# EAGLE design MTX_pic_piggyback (EAGLE 6.5.0)
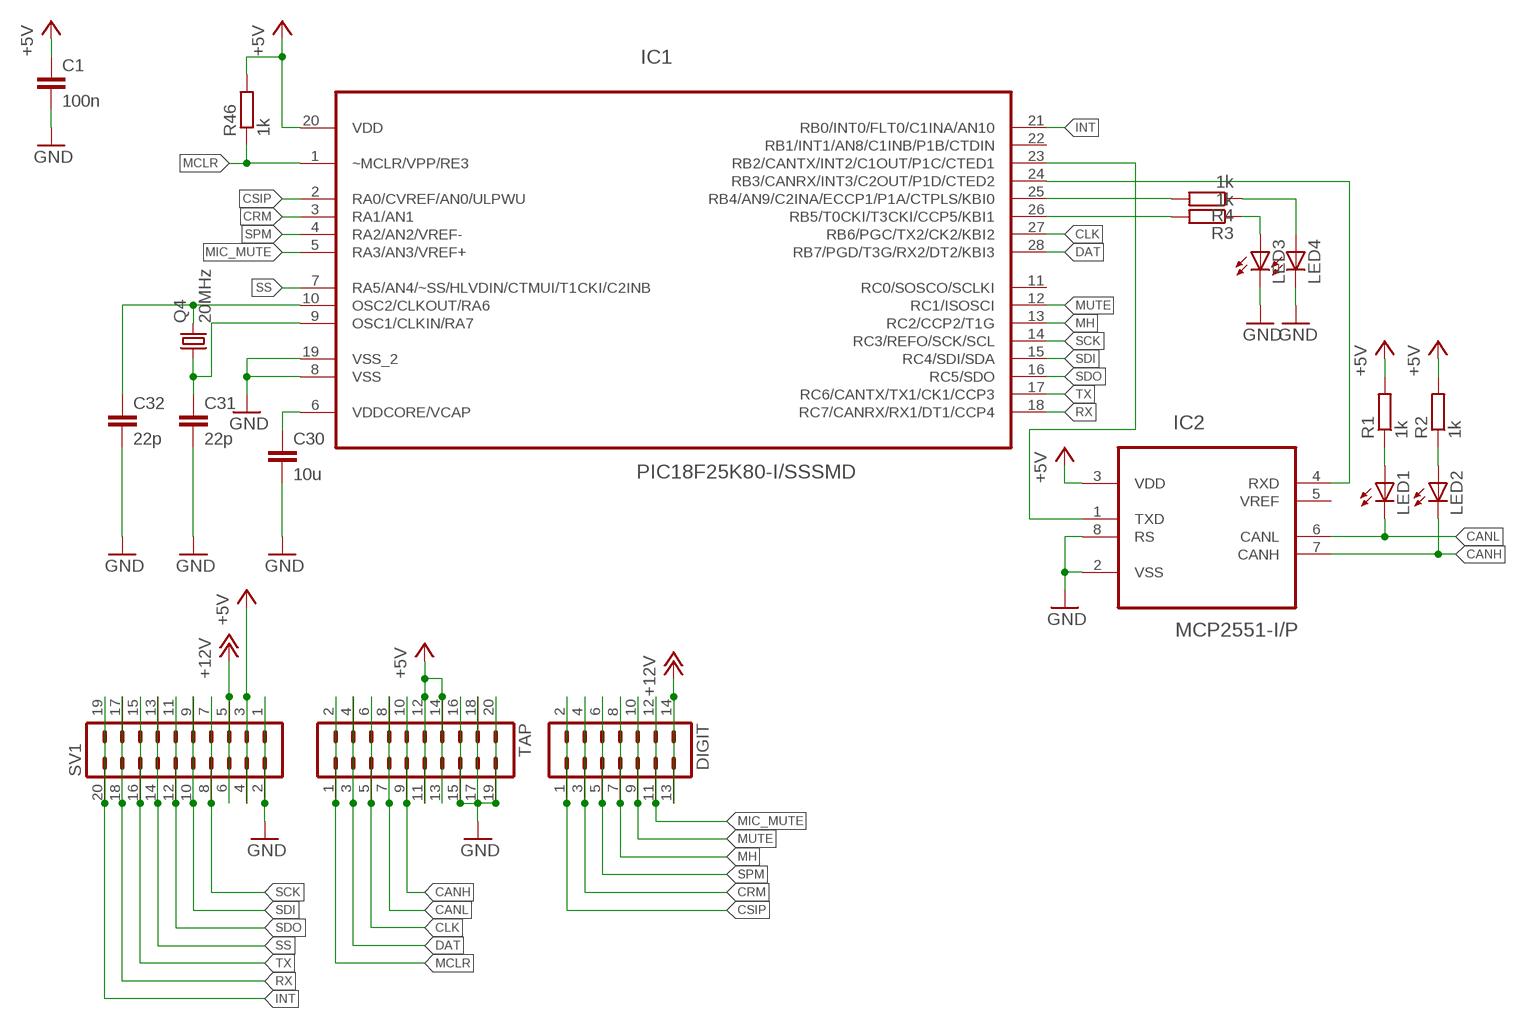
[diagram p0: schematic, sheet 1]

## Parts
C1  100n  C-EUC0805  [C0805]
C30  10u  C-EUC0805  [C0805]
C31  22p  C-EUC0805  [C0805]
C32  22p  C-EUC0805  [C0805]
DIGIT  MA07-2  [MA07-2]
IC1  PIC18F25K80-I/SSSMD  [SOP65P780X200-28N]
IC2  MCP2551-I/P  [DIP254P762X432-8]
LED1  LEDCHIP-LED0805  [CHIP-LED0805]
LED2  LEDCHIP-LED0805  [CHIP-LED0805]
LED3  LEDCHIP-LED0805  [CHIP-LED0805]
LED4  LEDCHIP-LED0805  [CHIP-LED0805]
Q4  20MHz  CRYSTALHC49UP  [HC49UP]
R1  1k  R-EU_R0805  [R0805]
R2  1k  R-EU_R0805  [R0805]
R3  1k  R-EU_R0805  [R0805]
R4  1k  R-EU_R0805  [R0805]
R46  1k  R-EU_R0805  [R0805]
SV1  MA10-2  [MA10-2]
TAP  MA10-2  [MA10-2]

## Nets
+5V: C1.1 IC1.20(VDD) IC2.3(VDD) R1.2 R2.2 R46.2 SV1.3 SV1.4 TAP.11 TAP.12 TAP.13 TAP.14
+12V: DIGIT.13 DIGIT.14 SV1.5 SV1.6
CANH: IC2.7(CANH) LED2.C TAP.9 TAP.10
CANL: IC2.6(CANL) LED1.C TAP.7 TAP.8
CLK: IC1.27(RB6/PGC/TX2/CK2/KBI2) TAP.5 TAP.6
CRM: DIGIT.3 DIGIT.4 IC1.3(RA1/AN1)
CSIP: DIGIT.1 DIGIT.2 IC1.2(RA0/CVREF/AN0/ULPWU)
DAT: IC1.28(RB7/PGD/T3G/RX2/DT2/KBI3) TAP.3 TAP.4
GND: C1.2 C30.2 C31.2 C32.2 IC1.8(VSS) IC1.19(VSS_2) IC2.2(VSS) IC2.8(RS) LED3.C LED4.C SV1.1 SV1.2 TAP.15 TAP.16 TAP.17 TAP.18 TAP.19 TAP.20
INT: IC1.21(RB0/INT0/FLT0/C1INA/AN10) SV1.19 SV1.20
MCLR: IC1.1(~MCLR/VPP/RE3) R46.1 TAP.1 TAP.2
MH: DIGIT.7 DIGIT.8 IC1.13(RC2/CCP2/T1G)
MIC_MUTE: DIGIT.11 DIGIT.12 IC1.5(RA3/AN3/VREF+)
MUTE: DIGIT.9 DIGIT.10 IC1.12(RC1/ISOSCI)
N$1: LED1.A R1.1
N$2: LED2.A R2.1
N$3: LED3.A R3.1
N$4: IC1.26(RB5/T0CKI/T3CKI/CCP5/KBI1) R3.2
N$5: LED4.A R4.1
N$6: IC1.25(RB4/AN9/C2INA/ECCP1/P1A/CTPLS/KBI0) R4.2
N$57: C30.1 IC1.6(VDDCORE/VCAP)
N$58: C31.1 IC1.9(OSC1/CLKIN/RA7) Q4.1
N$59: C32.1 IC1.10(OSC2/CLKOUT/RA6) Q4.2
N$86: IC1.24(RB3/CANRX/INT3/C2OUT/P1D/CTED2) IC2.4(RXD)
N$87: IC1.23(RB2/CANTX/INT2/C1OUT/P1C/CTED1) IC2.1(TXD)
RX: IC1.18(RC7/CANRX/RX1/DT1/CCP4) SV1.17 SV1.18
SCK: IC1.14(RC3/REFO/SCK/SCL) SV1.7 SV1.8
SDI: IC1.15(RC4/SDI/SDA) SV1.9 SV1.10
SDO: IC1.16(RC5/SDO) SV1.11 SV1.12
SPM: DIGIT.5 DIGIT.6 IC1.4(RA2/AN2/VREF-)
SS: IC1.7(RA5/AN4/~SS/HLVDIN/CTMUI/T1CKI/C2INB) SV1.13 SV1.14
TX: IC1.17(RC6/CANTX/TX1/CK1/CCP3) SV1.15 SV1.16
Unconnected: IC1.11(RC0/SOSCO/SCLKI) IC1.22(RB1/INT1/AN8/C1INB/P1B/CTDIN) IC2.5(VREF)

## Library data of the parts
C1 C30-C32 = rcl:C-EU: CAPACITOR, European symbol
DIGIT = con-lstb:MA07-2: PIN HEADER; OC_FARNELL: unknown; OC_NEWARK: unknown
IC1 = Microchip_By_element14_Batch_1:PIC18F25K80-I/SS
IC2 = Microchip_By_element14_Batch_1:MCP2551-I/P: High-Speed CAN Transceiver; DESCRIPTION: CAN CTRL; MPN: MCP2551-I/P; OC_FARNELL: 1292240; OC_NEWARK: 61K2947; PACKAGE: PDIP-8; SUPPLIER: Microchip
LED1-LED4 = led:LED: LED OSRAM: - CHIPLED LG R971, LG N971, LY N971, LG Q971, LY Q971, LO R971, LY R971 LH N974, LH R974 LS Q976, LO Q976, LY Q976 LO Q996 - Hyper CHIPLED LW Q18S LB Q993, LB Q99A, LB R99A - SideLED LS A670, LO A670, LY A670, LG A670, LP A670 LB A673, LV A673, LT A673, LW A673 LH A674 LY A675 LS A676, LA A676, LO A676, LY A676, LW A676 LS A679, LY A679, LG A679 - Hyper Micro SIDELED® LS Y876, LA Y876, LO Y876, LY Y876 LT Y87S - SmartLED LW L88C, LW L88S LB L89C, LB L89S, LG L890 LS L89K, LO L89K, LY L89K LS L896, LA L896, LO L896, LY L896 - TOPLED LS T670, LO T670, LY T670, LG T670, LP T670 LSG T670, LSP T670, LSY T670, LOP T670, LYG T670 LG T671, LOG T671, LSG T671 LB T673, LV T673, LT T673, LW T673 LH T674 LS T676, LA T676, LO T676, LY T676, LB T676, LH T676, LSB T676, LW T676 LB T67C, LV T67C, LT T67C, LS T67K, LO T67K, LY T67K, LW E67C LS E67B, LA E67B, LO E67B, LY E67B, LB E67C, LV E67C, LT E67C LW T67C LS T679, LY T679, LG T679 LS T770, LO T770, LY T770, LG T770, LP T770 LB T773, LV T773, LT T773, LW T773 LH T774 LS E675, LA E675, LY E675, LS T675 LS T776, LA T776, LO T776, LY T776, LB T776 LHGB T686 LT T68C, LB T68C - Hyper Mini TOPLED® LB M676 - Mini TOPLED Santana® LG M470 LS M47K, LO M47K, LY M47K Source: http://www.osram.convergy.de LUXEON: - LUMILED® LXK2-PW12-R00, LXK2-PW12-S00, LXK2-PW14-U00, LXK2-PW14-V00 LXK2-PM12-R00, LXK2-PM12-S00, LXK2-PM14-U00 LXK2-PE12-Q00, LXK2-PE12-R00, LXK2-PE12-S00, LXK2-PE14-T00, LXK2-PE14-U00 LXK2-PB12-K00, LXK2-PB12-L00, LXK2-PB12-M00, LXK2-PB14-N00, LXK2-PB14-P00, LXK2-PB14-Q00 LXK2-PR12-L00, LXK2-PR12-M00, LXK2-PR14-Q00, LXK2-PR14-R00 LXK2-PD12-Q00, LXK2-PD12-R00, LXK2-PD12-S00 LXK2-PH12-R00, LXK2-PH12-S00 LXK2-PL12-P00, LXK2-PL12-Q00, LXK2-PL12-R00 Source: www.luxeon.com KINGBRIGHT: KA-3528ASYC Source: www.kingbright.com
Q4 = crystal:CRYSTAL: CRYSTAL; OC_FARNELL: unknown; OC_NEWARK: unknown
R1-R4 R46 = rcl:R-EU_: RESISTOR, European symbol
SV1 TAP = con-lstb:MA10-2: PIN HEADER; OC_FARNELL: unknown; OC_NEWARK: unknown

## Board
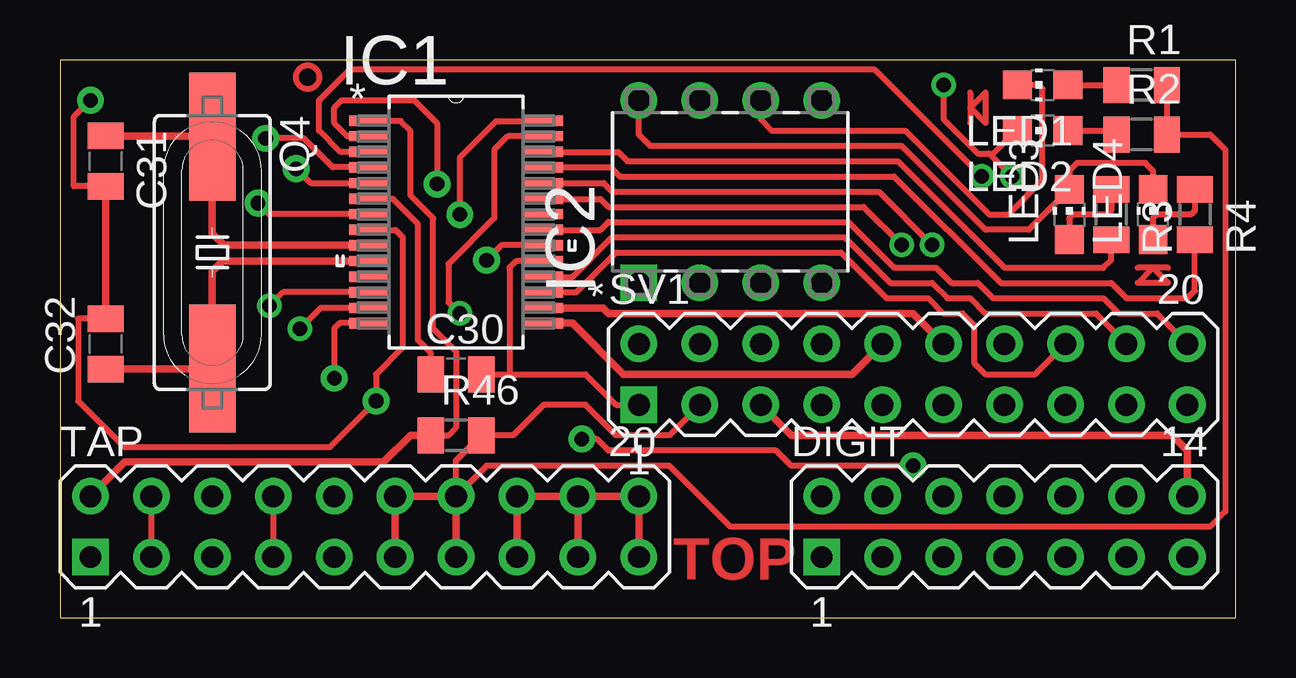
[diagram p1: board, top side]
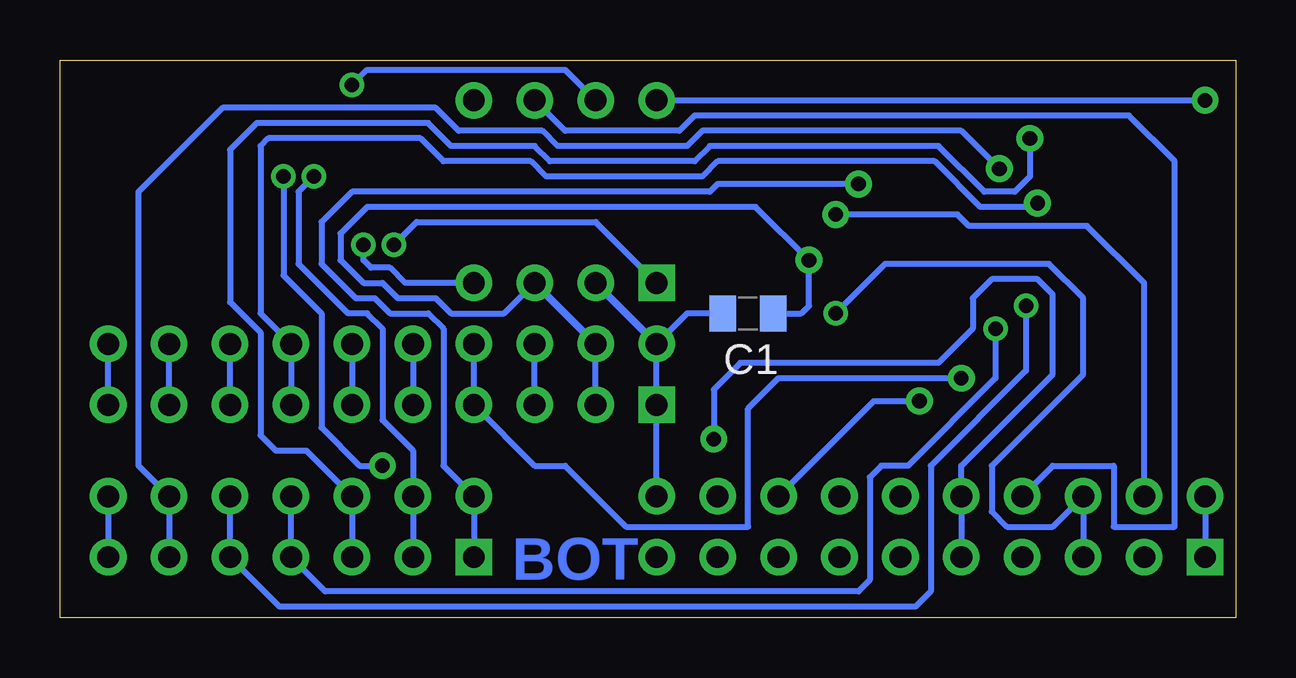
[diagram p2: board, bottom side, seen from below]

Size 49 x 23.27 mm. Coordinates in mm from the lower left corner, seen from the top.
Outline: 0,0 49,0 49,23.27 0,23.27 0,0
Copper layers (1*16): Top 0.035mm / dielectric 1.5mm / Bottom 0.035mm
Design rules "10mil": minimum track width 10mil, minimum drill 24mil, track to track 10mil, track to pad 10mil, pad to pad 10mil, via to via 10mil, smd to smd 10mil, copper to edge 10mil, drill to drill 10mil, minimum pad ring 10mil, minimum via ring 8mil, stop-mask expansion 4mil, vias tented up to drill 0mil, thermal gap 10mil

### Footprints (pad centres in the part's own frame; a part is rotated, then mirrored left to right if it is on the bottom)
C0805 = smd 1.1 x 1.5: 1 -1.05,0; 2 1.05,0
MA07-2 = drill 0.914 pad 1.524 square: 1 -7.62,-1.27 | drill 0.914 pad 1.524: 2 -7.62,1.27; 3 -5.08,-1.27; 4 -5.08,1.27; 5 -2.54,-1.27; 6 -2.54,1.27; 7 0,-1.27; 8 0,1.27; 9 2.54,-1.27; 10 2.54,1.27; 11 5.08,-1.27; 12 5.08,1.27; 13 7.62,-1.27; 14 7.62,1.27
SOP65P780X200-28N = smd 1.651 x 0.432: 1 -3.632,4.216; 2 -3.632,3.581; 3 -3.632,2.921; 4 -3.632,2.286; 5 -3.632,1.626; 6 -3.632,0.965; 7 -3.632,0.33; 8 -3.632,-0.33; 9 -3.632,-0.965; 10 -3.632,-1.626; 11 -3.632,-2.286; 12 -3.632,-2.921; 13 -3.632,-3.581; 14 -3.632,-4.216; 15 3.632,-4.216; 16 3.632,-3.581; 17 3.632,-2.921; 18 3.632,-2.286; 19 3.632,-1.626; 20 3.632,-0.965; 21 3.632,-0.33; 22 3.632,0.33; 23 3.632,0.965; 24 3.632,1.626; 25 3.632,2.286; 26 3.632,2.921; 27 3.632,3.581; 28 3.632,4.216
DIP254P762X432-8 = drill 0.914 pad 1.524 square: 1 -3.81,3.81 | drill 0.914 pad 1.524: 2 -3.81,1.27; 3 -3.81,-1.27; 4 -3.81,-3.81; 5 3.81,-3.81; 6 3.81,-1.27; 7 3.81,1.27; 8 3.81,3.81
CHIP-LED0805 = smd 1.2 x 1.2: A 0,-1.05; C 0,1.05
HC49UP = smd 5.334 x 1.93: 1 -4.826,0; 2 4.826,0
R0805 = smd 1.1 x 1.5: 1 -1.05,0; 2 1.05,0
MA10-2 = drill 0.914 pad 1.524 square: 1 -11.43,-1.27 | drill 0.914 pad 1.524: 2 -11.43,1.27; 3 -8.89,-1.27; 4 -8.89,1.27; 5 -6.35,-1.27; 6 -6.35,1.27; 7 -3.81,-1.27; 8 -3.81,1.27; 9 -1.27,-1.27; 10 -1.27,1.27; 11 1.27,-1.27; 12 1.27,1.27; 13 3.81,-1.27; 14 3.81,1.27; 15 6.35,-1.27; 16 6.35,1.27; 17 8.89,-1.27; 18 8.89,1.27; 19 11.43,-1.27; 20 11.43,1.27

### Placement (x,y rotation side)
C1  20.32,12.7 180 bottom
C30  16.51,10.16 0 top
C31  1.91,19.05 270 top
C32  1.91,11.43 90 top
DIGIT  39.37,3.81 0 top
IC1  16.51,16.51 0 top
IC2  27.94,17.78 90 top
LED1  40.96,22.22 90 top
LED2  40.96,20.32 90 top
LED3  42.07,16.83 0 top
LED4  45.56,16.83 0 top
Q4  6.35,15.24 270 top
R1  45.09,22.22 0 top
R2  45.09,20.16 0 top
R3  43.81,16.83 270 top
R4  47.31,16.83 270 top
R46  16.51,7.62 0 top
SV1  35.56,10.16 0 top
TAP  12.7,3.81 0 top

### Tracks (layer width: path | path; a pad name or v marks a point on that pad's centre or on a via)
+5V  (via drill 0.61 pad 1.12)
  Top 0.254: SV1.3 25.4,7.62 23.18,7.62 21.91,8.89 20.16,8.89 18.89,7.62 R46.2 16.51,6.57 TAP.14 17.78,6.35 25.4,6.35 27.94,3.81 47.94,3.81 48.58,4.45 48.58,19.53 47.94,20.16 R2.2 R1.2 | IC1.20 18.4,15.54 v17.78,14.92
  Top 0.305: TAP.11 TAP.12 TAP.14 TAP.13
  Bottom 0.254: SV1.3 SV1.4 | IC2.3 30.48,12.7 32.7,12.7 33.34,13.33 34.92,13.33 35.56,13.97 36.35,13.97 37.31,14.92 37.31,16.03 36.2,17.14 20,17.14 v17.78,14.92 17.78,13.02 18.1,12.7 C1.1
  Bottom 0.305: IC2.3 SV1.4
+12V
  Top 0.305: SV1.5 30.48,7.62 46.35,7.62 46.99,6.98 DIGIT.14
  Bottom 0.254: SV1.5 SV1.6 | DIGIT.14 DIGIT.13
CANH  (via drill 0.61, 0.61 pad 1.12)
  Top 0.254: v35.56,6.35 30.48,6.35 29.84,6.98 22.86,6.98 22.38,7.46 v21.75,7.46 | v36.83,22.22 36.83,20.8 38.26,19.37 38.73,19.37 38.81,19.29 | 38.81,19.29 v39.69,18.41 | LED2.C 39.85,20.32 38.81,19.29
  Bottom 0.254: v21.75,7.46 21.75,9.53 20.64,10.64 12.38,10.64 10.95,12.06 10.95,13.33 10.16,14.13 8.26,14.13 7.62,13.49 7.62,10.16 11.43,6.35 TAP.10 TAP.9 | v35.56,6.35 36.51,6.35 38.1,7.94 38.1,12.7 39.69,14.29 v39.69,18.41 | IC2.7 27.94,22.86 36.2,22.86 v36.83,22.22
CANL
  Top 0.254: TAP.8 TAP.7 | IC2.6 29.21,20.8 29.69,20.32 35.24,20.32 38.73,16.83 39.53,16.83 40.96,18.26 40.96,22.07 40.8,22.22 LED1.C
  Bottom 0.254: TAP.8 7.62,6.35 5.08,6.35 5.08,3.81 2.54,3.81 2.54,19.05 4.45,20.95 22.54,20.95 23.18,20.32 27.94,20.32 IC2.6
CLK  (via drill 0.61)
  Top 0.254: IC1.27 18.66,20.09 18.1,19.53 18.1,16.67 16.19,14.76 16.19,13.18 v16.67,12.7
  Bottom 0.254: TAP.5 TAP.6 7.62,3.81 9.53,3.81 10.16,4.45 10.16,6.35 6.35,10.16 6.35,13.33 7.78,14.76 14.61,14.76 v16.67,12.7
CRM  (via drill 0.61)
  Top 0.254: IC1.3 11.68,19.43 10.79,20.32 10.79,21.59 12.06,22.86 33.97,22.86 v38.42,18.41
  Bottom 0.254: DIGIT.3 DIGIT.4 34.29,6.98 35.56,8.26 35.56,12.06 36.2,12.7 36.99,12.7 39.05,14.76 39.05,17.78 v38.42,18.41
CSIP  (via drill 0.61 pad 1.12)
  Top 0.254: IC1.2 11.98,20.09 11.43,20.64 11.43,21.27 11.75,21.59 14.76,21.59 15.72,20.64 v15.72,18.1
  Bottom 0.254: DIGIT.1 DIGIT.2 33.02,6.35 33.02,12.06 33.66,12.7 35.24,12.7 35.88,13.33 36.67,13.33 38.1,14.76 38.1,16.51 36.83,17.78 21.91,17.78 21.59,18.1 v15.72,18.1
DAT  (via drill 0.61 pad 1.12)
  Top 0.254: TAP.4 TAP.3 | v16.67,16.83 16.67,19.21 18.19,20.73 IC1.28
  Bottom 0.254: TAP.4 3.81,13.97 6.19,16.35 11.11,16.35 11.59,16.83 v16.67,16.83
GND  (via drill 0.61 pad 1.12)
  Top 0.254: C32.2 0.76,12.48 0.76,9.05 2.68,7.12 11.25,7.12 v13.18,9.05 13.18,10.16 14.29,11.27 14.29,15.88 13.98,16.18 IC1.8 | C31.2 0.58,18 0.58,20.9 v1.27,21.59 | IC1.19 19.01,14.88 18.73,14.61 18.73,10.16 | C30.2 18.73,10.16 | 18.73,10.16 21.91,10.16 23.18,8.89 SV1.1 | IC2.8 24.13,20.16 24.61,19.68 35.08,19.68 38.58,16.19 40.38,16.19 LED3.C 42.07,18.65 42.39,18.97 45.24,18.97 45.56,18.65 LED4.C
  Top 0.305: C32.2 C31.2 | TAP.18 TAP.20 TAP.19 | TAP.18 TAP.16 TAP.15 | TAP.17 TAP.18
  Bottom 0.254: TAP.16 15.08,9.05 v13.18,9.05 | IC2.8 v1.27,21.59 | TAP.20 SV1.1 SV1.2 22.86,12.7 C1.2
  Bottom 0.305: IC2.2 SV1.2
INT
  Top 0.254: IC1.21 22.53,16.18 22.86,16.51 32.86,16.51 34.77,14.61 36.51,14.61 37.15,13.97 38.26,13.97 38.89,13.33 43.5,13.33 44.13,12.7 45.72,12.7 SV1.20
  Bottom 0.254: SV1.19 SV1.20
MCLR
  Top 0.254: R46.1 16.19,7.62 16.51,7.94 16.51,11.11 15.56,12.06 15.56,16.67 14.61,17.62 14.61,20.32 14.2,20.73 IC1.1
  Top 0.305: R46.1 14.61,7.62 13.49,6.51 2.7,6.51 TAP.2
  Bottom 0.254: TAP.2 TAP.1
MH  (via drill 0.61)
  Top 0.254: IC1.13 10.87,12.93 v10,12.06
  Bottom 0.254: DIGIT.8 DIGIT.7 37.94,1.11 15.72,1.11 15.24,1.59 15.24,5.87 14.76,6.35 13.65,6.35 10,10 v10,12.06
MIC_MUTE  (via drill 0.61 pad 1.12)
  Top 0.254: IC1.5 10.44,18.14 v9.84,18.73
  Bottom 0.254: DIGIT.11 DIGIT.12 45.72,6.35 45.72,17.78 42.23,21.27 33.34,21.27 32.38,20.32 28.89,20.32 28.26,19.68 22.86,19.68 22.23,20.32 11.43,20.32 v9.84,18.73
MUTE  (via drill 0.61)
  Top 0.254: IC1.12 9.3,13.59 v8.73,13.02
  Bottom 0.254: DIGIT.10 DIGIT.9 39.85,0.48 13.34,0.48 12.7,1.11 12.7,6.35 8.73,10.32 v8.73,13.02
N$1
  Top 0.254: LED1.A R1.1
N$2
  Top 0.254: LED2.A 43.88,20.32 R2.1
N$3
  Top 0.254: R3.1 43.81,16.99 43.66,16.83 42.23,16.83 42.07,16.67 LED3.A
N$4
  Top 0.254: IC1.26 23.27,19.43 23.65,19.05 34.92,19.05 39.37,14.61 43.5,14.61 43.81,14.92 R3.2
N$5
  Top 0.254: R4.1 47.31,16.99 47.15,16.83 45.72,16.83 45.56,16.67 LED4.A
N$6
  Top 0.254: IC1.25 22.95,18.8 23.34,18.41 34.77,18.41 39.21,13.97 43.81,13.97 44.45,13.33 46.99,13.33 47.31,13.65 R4.2
N$7
  Top 0.254: 38.58,21.91 38.58,20.64 37.94,21.27 38.58,21.91
N$8
  Top 0.254: 37.94,21.91 37.94,20.64
N$10
  Top 0.254: 46.2,13.97 44.93,13.97 45.56,14.61 46.2,13.97
N$11
  Top 0.254: 46.2,14.61 44.93,14.61
N$57
  Top 0.254: C30.1 15.46,11.05 14.92,11.59 14.92,16.43 13.88,17.47 IC1.6
N$58
  Top 0.305: IC1.9 6.84,15.54 6.35,16.03 Q4.1 6.32,20.1 C31.1
N$59
  Top 0.305: IC1.10 6.79,14.88 6.35,14.45 Q4.2 6.32,10.38 C32.1
N$86  (via drill 0.61)
  Top 0.254: IC1.24 22.66,18.14 23.02,17.78 34.13,17.78 v36.35,15.56
  Bottom 0.254: IC2.4 34.61,13.97 35.24,14.61 36.04,14.61 36.35,14.92 v36.35,15.56
N$87  (via drill 0.61)
  Top 0.254: IC1.23 22.53,17.47 22.86,17.14 33.5,17.14 v35.08,15.56
  Bottom 0.254: v35.08,15.56 34.13,16.51 26.67,16.51 IC2.1
RX
  Top 0.254: IC1.18 21.37,14.22 23.02,15.88 32.7,15.88 34.61,13.97 36.35,13.97 36.99,13.33 37.94,13.33 38.58,12.7 43.18,12.7 SV1.18
  Bottom 0.254: SV1.17 SV1.18
SCK  (via drill 0.61 pad 1.12)
  Top 0.254: IC1.14 11.66,12.29 11.43,12.06 v11.43,10
  Bottom 0.254: v11.43,10 19.05,10 20.32,8.73 20.32,3.81 25.4,3.81 27.94,6.35 29.21,6.35 SV1.7 SV1.8
SDI
  Top 0.305: IC1.15 21.36,12.29 23.5,10.16 33.02,10.16 SV1.10
  Bottom 0.254: SV1.10 SV1.9
SDO
  Top 0.305: IC1.16 22.63,12.93 22.86,12.7 35.56,12.7 SV1.12
  Bottom 0.254: SV1.12 SV1.11
SPM  (via drill 0.61 pad 1.12)
  Top 0.254: IC1.4 11.37,18.8 10.16,20 v8.57,20
  Bottom 0.254: DIGIT.5 DIGIT.6 38.73,6.98 40.01,6.98 40.64,7.62 40.64,11.91 41.91,13.18 41.91,19.53 40.8,20.64 33.66,20.64 32.7,19.68 29.21,19.68 28.57,19.05 22.54,19.05 21.91,19.68 12.38,19.68 10.48,17.78 9.21,17.78 8.57,18.41 v8.57,20
SS  (via drill 0.61 pad 1.12)
  Top 0.254: IC1.7 8.72,16.84 v8.26,17.3
  Bottom 0.254: SV1.13 SV1.14 40.64,12.7 40.64,19.68 40.32,20 33.97,20 33.02,19.05 29.37,19.05 28.73,18.41 22.23,18.41 21.59,19.05 12.54,19.05 10.64,17.14 8.41,17.14 v8.26,17.3
TX
  Top 0.254: IC1.17 21.53,13.59 23.18,15.24 32.54,15.24 34.45,13.33 36.2,13.33 36.83,12.7 37.62,12.7 38.1,12.22 38.1,10.64 38.58,10.16 40.64,10.16 SV1.16
  Bottom 0.254: SV1.15 SV1.16
(copper drawn outside any net)
  shapes: Top circle x1

### Text on the board
Top: TOP
Bottom: BOT
tTest: 5V | 12V | CLK | SDI | SDO | SS | TX | RX | INT